# Altium schematic sheet 原理图.schdoc
size 309 x 223 mm; Symbol: Sheet-Symbol_A4; Device: Sheet-Symbol_A4; Company: 嘉立创EDA; Version: V1.0; Page Size: A4; @Project Name: 智能家居语音系统（升级版）; @Page Count: 1; @Update Date: 2024-05-09; @Create Date: 2024-05-07; @Schematic Name: 智能家居语音系统（升级版）; @Page No: 1; @Page Name: 智能家居语音系统（升级版）
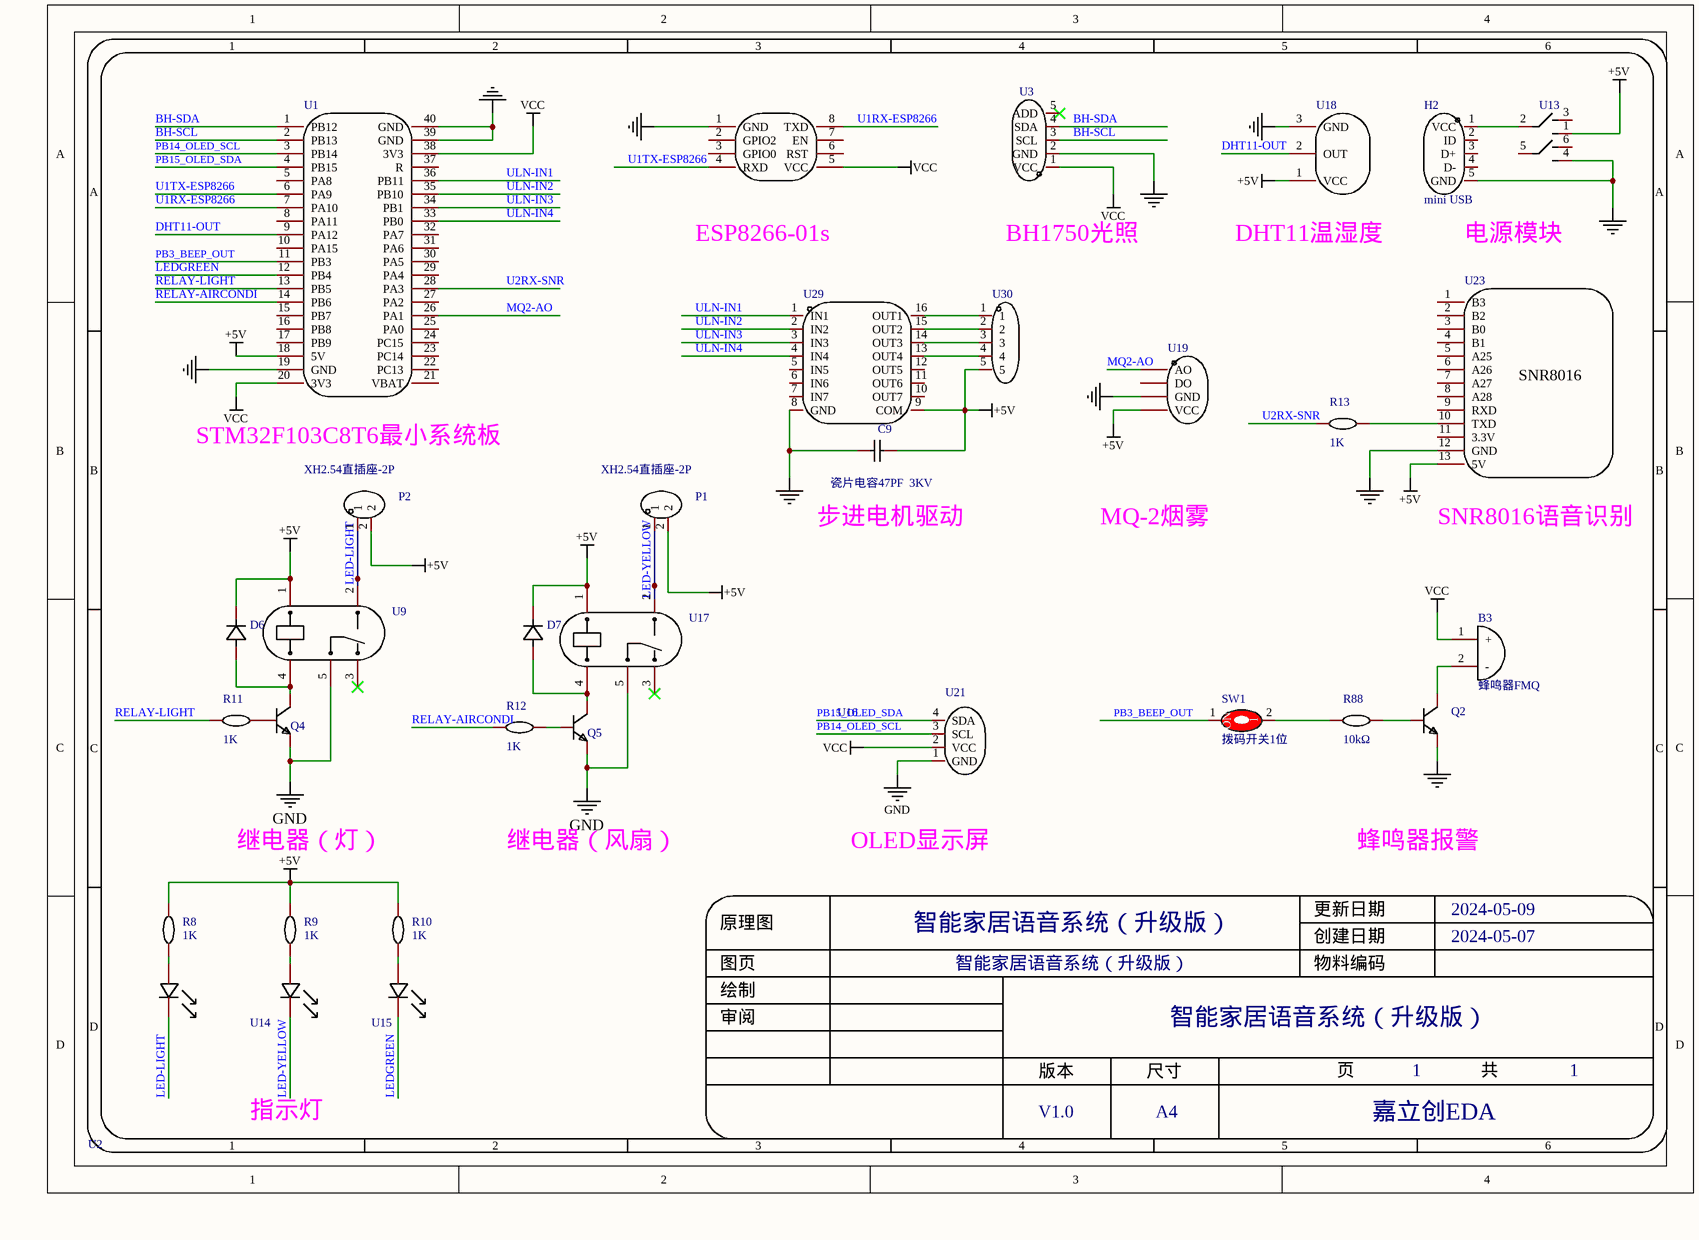
[diagram p0: 原理图.schdoc]

## Parts
B3  蜂鸣器FMQ  [蜂鸣器]
C9  瓷片电容47PF  3KV  [CAP-TH_L5.0-W4.0-P5.00-D1.0]
D6  D_1N4007A  [DO_1N4007]  (value not drawn)
D7  D_1N4007A  [DO_1N4007]  (value not drawn)
H2  mini USB  [MINI-USB-POWER]
P1  XH2.54直插座-2P  [CONN-TH_XH2.54-2P]
P2  XH2.54直插座-2P  [CONN-TH_XH2.54-2P]
Q2  S8050_TO_NPN  [S8050_TO_92]  (value not drawn)
Q4  S8050_TO_NPN  [S8050_TO_92]  (value not drawn)
Q5  S8050_TO_NPN  [S8050_TO_92]  (value not drawn)
R8  1K  [Res_1/4W]
R9  1K  [Res_1/4W]
R10  1K  [Res_1/4W]
R11  1K  [Res_1/4W]
R12  1K  [Res_1/4W]
R13  1K  [Res_1/4W]
R88  10kΩ  [Res_1/4W]
SW1  拨码开关1位  [SW-TH_DSWB01LHGET]
U1  STM32F103C8T6小蓝板  [STM32F103C8T6最小系统板(蓝)]  (value not drawn)
U2  ESP8266-01S模块  [ESP8266-01S模块]  (value not drawn)
U3  GY302光照传感器  [GY302光照传感器]  (value not drawn)
U9  继电器5V  [继电器DC5V]  (value not drawn)
U13  按键开关7*7  [按键开关7*7]  (value not drawn)
U14  LED_5mm  [LED_5mm]  (value not drawn)
U15  LED_5mm  [LED_5mm]  (value not drawn)
U16  LED_5mm  [LED_5mm]  (value not drawn)
U17  继电器5V  [继电器DC5V]  (value not drawn)
U18  DHT11温湿度传感器  [DHT11]  (value not drawn)
U19  MQ系列4针传感器  [MQ系列4针传感器]  (value not drawn)
U21  OLED四针0.96寸  [OLED4针0.96寸]  (value not drawn)
U23  SNR8016语音识别  [SNR8016]  (value not drawn)
U29  ULN2003A  [DIP-16_L20.0-W6.4-P2.54-LS7.6-BL]  (value not drawn)
U30  步进电机  [conn-th_5p-p2.54_xh2.54_5p_dip]  (value not drawn)

## Nets
+5V: C9.2 D6.1(K) D7.1(K) P1.2 P2.2 R8.2 R9.2 R10.2 U1.18(5V) U9.1 U13.1 U17.1 U18.1(VCC) U19.4(VCC) U23.13(5V) U29.9(COM) U30.5
GND: Q4.1(E) Q5.1(E) U9.5 U17.5 U21.1(GND)
NetC9_1: C9.1 H2.5(GND) Q2.1(E) U1.19(GND) U1.39(GND) U1.40(GND) U2.1(GND) U3.2(GND) U13.4 U18.3(GND) U19.3(GND) U23.12(GND) U29.8(GND)
VCC: B3.1(+) U1.20(3V3) U1.38(3V3) U2.5(VCC) U3.1(VCC) U21.2(VCC)
BH-SCL: U1.2(PB13) U3.3(SCL)
BH-SDA: U1.1(PB12) U3.4(SDA)
DHT11-OUT: U1.9(PA12) U18.2(OUT)
LED-LIGHT: P2.1 U9.2 U14.1(C)
LED-YELLOW: P1.1 U15.1(C) U17.2
LEDGREEN: U1.12(PB4) U16.1(C)
MQ2-AO: U1.26(PA1) U19.1(AO)
PB3_BEEP_OUT: SW1.1 U1.11(PB3)
PB14_OLED_SCL: U1.3(PB14) U21.3(SCL)
PB15_OLED_SDA: U1.4(PB15) U21.4(SDA)
RELAY-AIRCONDI: R12.2 U1.14(PB6)
RELAY-LIGHT: R11.2 U1.13(PB5)
U1RX-ESP8266: U1.7(PA10) U2.8(TXD)
U1TX-ESP8266: U1.6(PA9) U2.4(RXD)
U2RX-SNR: R13.2 U1.28(PA3)
ULN-IN1: U1.36(PB11) U29.1(IN1)
ULN-IN2: U1.35(PB10) U29.2(IN2)
ULN-IN3: U1.34(PB1) U29.3(IN3)
ULN-IN4: U1.33(PB0) U29.4(IN4)
NetB3_2: B3.2(-) Q2.3(C)
NetD6_2: D6.2(A) Q4.3(C) U9.4
NetD7_2: D7.2(A) Q5.3(C) U17.4
NetH2_1: H2.1(VCC) U13.2
NetQ2_2: Q2.2(B) R88.2
NetQ4_2: Q4.2(B) R11.1
NetQ5_2: Q5.2(B) R12.1
NetR8_1: R8.1 U14.2(A)
NetR9_1: R9.1 U15.2(A)
NetR10_1: R10.1 U16.2(A)
NetR13_1: R13.1 U23.10(TXD)
NetR88_1: R88.1 SW1.2
NetU29_13: U29.13(OUT4) U30.4
NetU29_14: U29.14(OUT3) U30.3
NetU29_15: U29.15(OUT2) U30.2
NetU29_16: U29.16(OUT1) U30.1

Not connected (* = marked no-connect by the designer): H2 2(ID) 3(D+) 4(D-); U1 5(PA8) 8(PA11) 10(PA15) 15(PB7) 16(PB8) 17(PB9) 21(VBAT) 22(PC13) 23(PC14) 24(PC15) 25(PA0) 27(PA2) 29(PA4) 30(PA5) 31(PA6) 32(PA7) 37(R); U2 2(GPIO2) 3(GPIO0) 6(RST) 7(EN); U3 5(ADD)*; U9 3*; U13 3 5 6; U17 3*; U19 2(DO); U23 1(B3) 2(B2) 3(B0) 4(B1) 5(A25) 6(A26) 7(A27) 8(A28) 9(RXD) 11(3.3V); U29 5(IN5) 6(IN6) 7(IN7) 10(OUT7) 11(OUT6) 12(OUT5)

## Notes on the sheet
- ESP8266-01s
- BH1750光照
- (near U18) DHT11温湿度
- 电源模块
- (near U1) STM32F103C8T6最小系统板
- 步进电机驱动
- MQ-2烟雾
- (near U23) SNR8016语音识别
- 继电器（灯）
- 继电器（风扇）
- OLED显示屏
- 蜂鸣器报警
- 指示灯
- 1
- 2
- 3
- 4
- 5
- 6
- A
- B
- C
- 原理图
- 智能家居语音系统（升级版）
- 创建日期
- 更新日期
- 2024-05-09
- 2024-05-07
- 审阅
- 绘制
- 图页
- 物料编码
- D
- 版本
- 尺寸
- 页
- 共
- V1.0
- A4
- 嘉立创EDA
- (in symbol SNR8016语音识别) SNR8016
- (in symbol 拨码开关1位) ON

## Library data of the parts
B3 = 蜂鸣器FMQ: Add into BOM: yes; Name: 蜂鸣器FMQ; Symbol: 蜂鸣器FMQ; Device: 蜂鸣器FMQ; Convert to PCB: yes
C9 = 瓷片电容47PF  3KV: Symbol: Ceramic capacitors47PF 3KV; Add into BOM: yes; Name: 瓷片电容47PF  3KV; Device: 瓷片电容47PF  3KV; LCSC Part Name: 47pF(47R) ±10% 3KV; Supplier Part: C19375; Manufacturer Part: 瓷片电容47PF  3KV; Supplier Footprint: Through Hole; JLCPCB Part Class: 扩展库; Datasheet: https://atta.szlcsc.com/upload/public/pdf/source/20151026/1457707498987.pdf; Supplier: LCSC; Convert to PCB: yes
D6 D7 = D_1N4007A: Add into BOM: yes; Check: false; Symbol: D_1N4007; Device: D_1N4007A; Supplier Footprint: DO-41; Convert to PCB: yes
H2 = mini USB: Add into BOM: yes; Check: false; Name: mini USB; Symbol: mini USB; Device: mini USB; Convert to PCB: yes
P1 P2 = XH2.54直插座-2P: Add into BOM: yes; Check: false; Name: XH2.54直插座-2P; Symbol: XH2.54直插座-2P; Device: XH2.54直插座-2P; LCSC Part Name: XH2.54直插座-2P; Supplier Part: C9900016957; Manufacturer Part: XH2.54直插座-2P; Supplier Footprint: XH2.54-2; JLCPCB Part Class: 扩展库; Datasheet: https://atta.szlcsc.comnull; Supplier: LCSC; Convert to PCB: yes
Q2 = S8050_TO_NPN: Convert to PCB: yes; Symbol: S8050_TO_NPN; Device: S8050_TO_NPN; Add into BOM: yes; Supplier Footprint: TO-92
Q4 Q5 = S8050_TO_NPN: Convert to PCB: yes; Check: false; Symbol: S8050_TO_NPN; Device: S8050_TO_NPN; Add into BOM: yes; Supplier Footprint: TO-92
R8-R13 = Res_AXIAL-1/4W: Symbol: 电阻; Add into BOM: yes; Check: false; Name: 1K; Device: Res_AXIAL-1/4W; Supplier Footprint: 轴向引线; Convert to PCB: yes; Value: 1K
R88 = Res_AXIAL-1/4W: Symbol: 电阻; Add into BOM: yes; Name: 10kΩ; Device: Res_AXIAL-1/4W; Supplier Footprint: 轴向引线; Convert to PCB: yes; Value: 10kΩ
U2 = ESP8266-01S模块: Check: false; Symbol: ESP8266-01S模块; Device: ESP8266-01S模块
U3 = GY302光照传感器: Add into BOM: yes; Symbol: GY302光照传感器; Device: GY302光照传感器; Convert to PCB: yes
U9 U17 = 继电器5V: Add into BOM: yes; Check: false; Symbol: 继电器5V; Device: 继电器5V; Convert to PCB: yes
U13 = 按键开关7*7: Add into BOM: yes; Check: false; Symbol: 按键开关7*7; Device: 按键开关7*7; Convert to PCB: yes
U14-U16 = LED_5mm: Add into BOM: yes; Check: false; Symbol: LED_5mm; Device: LED_5mm; Convert to PCB: yes
U18 = DHT11温湿度传感器: Add into BOM: yes; Check: false; Symbol: DHT11温湿度传感器; Device: DHT11温湿度传感器; Convert to PCB: yes
U19 = MQ系列4针传感器: Add into BOM: yes; Check: false; Symbol: MQ系列4针传感器; Device: MQ系列4针传感器; Convert to PCB: yes
U21 = OLED四针0.96寸: Add into BOM: yes; Check: false; Symbol: OLED四针0.96寸; Device: OLED四针0.96寸; Convert to PCB: yes
U23 = SNR8016语音识别: Add into BOM: yes; Check: false; Name: SNR8016语音识别; Symbol: SNR8016语音识别; Device: SNR8016语音识别; Convert to PCB: yes
U29 = ULN2003A: Manufacturer: ST(意法半导体); Symbol: ULN2003A_C93000; Add into BOM: yes; Name: ULN2003A; Device: ULN2003A; LCSC Part Name: ULN2003A; Supplier Part: C93000; Manufacturer Part: ULN2003A; Supplier Footprint: DIP-16; JLCPCB Part Class: 扩展库; Datasheet: https://atta.szlcsc.com/upload/public/pdf/source/20171116/C93000_15108227945891124497.pdf; Supplier: LCSC; Convert to PCB: yes; Origin Footprint 2: DIP-16_L20.0-W6.4-P2.54-LS7.6-BL; Origin Footprint 1: ULN2003A_C93000
U30 = 步进电机: Symbol: Header5; Add into BOM: yes; Origin Footprint 2: CONN-TH_HEADER5; Name: 步进电机; Device: 步进电机; LCSC Part Name: Header5; Supplier Part: C9900003337; Manufacturer Part: 步进电机; Supplier Footprint: XH2.54-P5; JLCPCB Part Class: 扩展库; Supplier: LCSC; Convert to PCB: yes; Origin Footprint 1: Header5
SW1 = 拨码开关1位: Name: 拨码开关1位; Symbol: 拨码开关1位; Device: 拨码开关1位
U1 = STM32F103C8T6小蓝板: Symbol: STM32F103C8T6小蓝板; Device: STM32F103C8T6小蓝板